# EAGLE design TAH BOARD VER 2.0 (EAGLE 6.4)
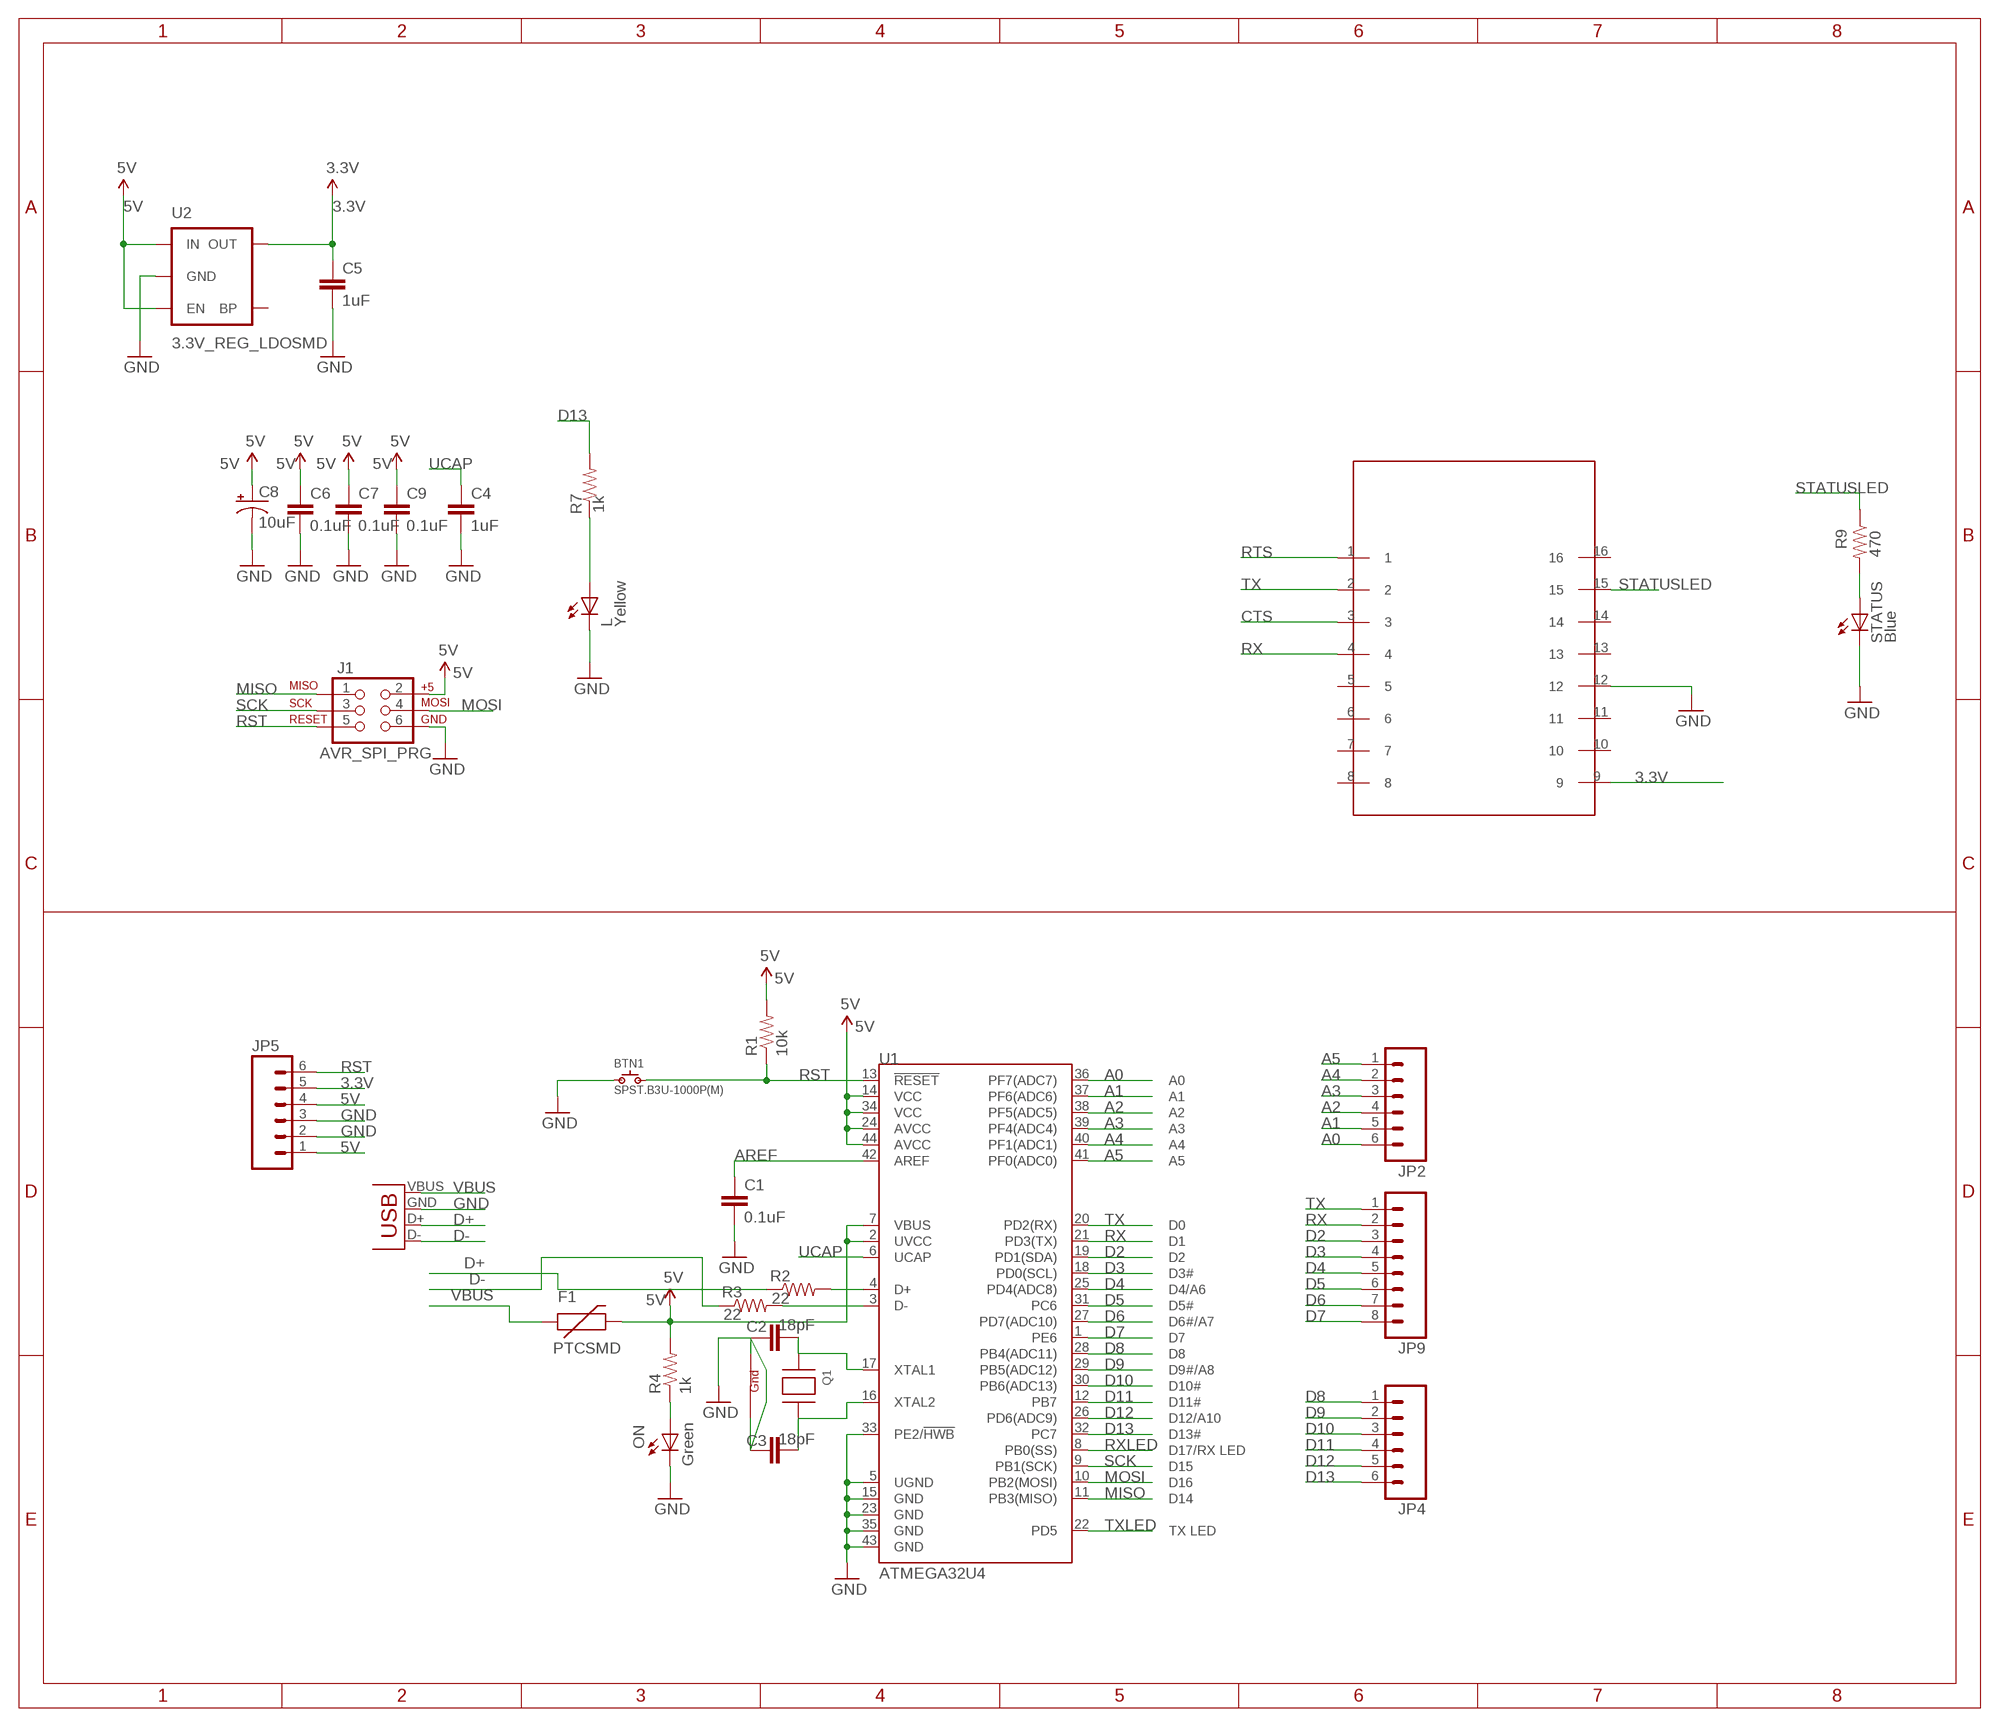
[diagram p0: schematic, sheet 1]

## Parts
BLE  HM-11HM11  [BC05B-SMD]
BTN1  SPST.B3U-1000P(M)  [B3U-1000P(M)]
C1  0.1uF  2.2UF-CERCAP-10009  [1206]
C2  18pF  2.2UF-CERCAP-10009  [1206]
C3  18pF  2.2UF-CERCAP-10009  [1206]
C4  1uF  2.2UF-CERCAP-10009  [1206]
C5  1uF  2.2UF-CERCAP-10009  [1206]
C6  0.1uF  2.2UF-CERCAP-10009  [1206]
C7  0.1uF  2.2UF-CERCAP-10009  [1206]
C8  10uF  CAP_POL1206  [EIA3216]
C9  0.1uF  2.2UF-CERCAP-10009  [1206]
F1  PTCSMD  [PTC-1206]
J1  AVR_SPI_PRG  AVR_SPI_PRG_6PTH  [2X3]
JP2  M06SIP  [1X06]
JP4  M06SIP  [1X06]
JP5  M06SIP  [1X06]
JP7  USB-A-H  [USB-A-H]
JP9  M081X08  [1X08]
L  Yellow  LEDSMT1206  [1206]
ON  Green  LEDSMT1206  [1206]
Q1  XTAL-4-3225  [NX3225]
R1  10k  RESISTOR1206  [1206]
R2  22  RESISTOR1206  [1206]
R3  22  RESISTOR1206  [1206]
R4  1k  RESISTOR1206  [1206]
R7  1k  RESISTOR1206  [1206]
R9  470  RESISTOR1206  [1206]
STATUS  Blue  LEDSMT1206  [1206]
U1  ATMEGA32U4  ATMEGA32U4TQFP  [SPARKFUN-DIGITALIC_TQFP44]
U2  3.3V_REG_LDOSMD  V_REG_LDOSMD  [SOT23-5]

## Nets
3.3V: BLE.9 C5.1 JP5.5 U2.5(OUT)
5V: C6.1 C7.1 C8.A(+) C9.1 F1.2 J1.2 JP5.1 JP5.4 R1.2 R4.2 U1.2(UVCC) U1.7(VBUS) U1.14(VCC) U1.24(AVCC) U1.34(VCC) U1.44(AVCC) U2.1(IN) U2.3(EN)
A0: JP2.6 U1.36(PF7(ADC7))
A1: JP2.5 U1.37(PF6(ADC6))
A2: JP2.4 U1.38(PF5(ADC5))
A3: JP2.3 U1.39(PF4(ADC4))
A4: JP2.2 U1.40(PF1(ADC1))
A5: JP2.1 U1.41(PF0(ADC0))
AREF: C1.1 U1.42(AREF)
CTS: BLE.3
D2: JP9.3 U1.19(PD1(SDA))
D3: JP9.4 U1.18(PD0(SCL))
D4: JP9.5 U1.25(PD4(ADC8))
D5: JP9.6 U1.31(PC6)
D6: JP9.7 U1.27(PD7(ADC10))
D7: JP9.8 U1.1(PE6)
D8: JP4.1 U1.28(PB4(ADC11))
D9: JP4.2 U1.29(PB5(ADC12))
D10: JP4.3 U1.30(PB6(ADC13))
D11: JP4.4 U1.12(PB7)
D12: JP4.5 U1.26(PD6(ADC9))
D13: JP4.6 R7.2 U1.32(PC7)
D+: JP7.D+(D-) R2.1
D-: JP7.D-(D+) R3.1
GND: BLE.12 BTN1.1 C1.2 C2.1 C3.1 C4.2 C5.2 C6.2 C7.2 C8.C(-) C9.2 J1.6 JP5.2 JP5.3 JP7.GND(VBUS) L.C ON.C Q1.2(G2) Q1.4(G1) STATUS.C U1.5(UGND) U1.15(GND) U1.23(GND) U1.33(PE2/!HWB) U1.35(GND) U1.43(GND) U2.2(GND)
MISO: J1.1 U1.11(PB3(MISO))
MOSI: J1.4 U1.10(PB2(MOSI))
N$1: L.A R7.1
N$2: C2.2 Q1.1(X1) U1.17(XTAL1)
N$3: C3.2 Q1.3(X2) U1.16(XTAL2)
N$6: R2.2 U1.4(D+)
N$8: R3.2 U1.3(D-)
N$9: ON.A R4.1
N$11: R9.2 STATUS.A
RST: BTN1.2 J1.5 JP5.6 R1.1 U1.13(!RESET)
RTS: BLE.1
RX: BLE.4 JP9.2 U1.21(PD3(TX))
RXLED: U1.8(PB0(SS))
SCK: J1.3 U1.9(PB1(SCK))
STATUSLED: BLE.15 R9.1
TX: BLE.2 JP9.1 U1.20(PD2(RX))
TXLED: U1.22(PD5)
UCAP: C4.1 U1.6(UCAP)
VBUS: F1.1 JP7.VBUS(GND)
Unconnected: BLE.5 BLE.6 BLE.7 BLE.8 BLE.10 BLE.11 BLE.13 BLE.14 BLE.16 U2.4(BP)

## Library data of the parts
BLE = HM-11:HM-11
BTN1 = omron:SPST
C1-C7 C9 = SparkFun-Capacitors:2.2UF-CER: 2.2uF Ceramic SMT CAP-07888- 10V, 20% (0603) CAP-10009- 50V, 10% (1206); PROD_ID: CAP-10009; VALUE: 2.2uF
C8 = SparkFun:CAP_POL: Capacitor Polarized These are standard SMD and PTH capacitors. Normally 10uF, 47uF, and 100uF in electrolytic and tantalum varieties. Always verify the external diameter of the through hole cap, it varies with capacity, voltage, and manufacturer. The EIA devices should be standard.
F1 = SparkFun:PTC: Resettable Fuse PTC Resettable Fuse. Spark Fun Electronics SKU : COM-08357
J1 = SparkFun:AVR_SPI_PRG_6: AVR ISP 6 Pin This is the reduced ISP connector for AVR programming. Common on Arduino. This footprint will take up less PCB space and can be used with a 10-pin to 6-pin adapter such as SKU: BOB-08508
JP2 JP4 JP5 = SparkFun-Connectors:M06: Header 6 Standard 6-pin 0.1" header. Use with straight break away headers (SKU : PRT-00116), right angle break away headers (PRT-00553), swiss pins (PRT-00743), machine pins (PRT-00117), and female headers (PRT-00115). Molex polarized connector foot print use with SKU : PRT-08094 with associated crimp pins and housings. NOTES ON THE VARIANTS LOCK and LOCK_LONGPADS... This footprint was designed to help hold the alignment of a through-hole component (i.e. 6-pin header) while soldering it into place. You may notice that each hole has been shifted either up or down by 0.005 of an inch from it's more standard position (which is a perfectly straight line). This slight alteration caused the pins (the squares in the middle) to touch the edges of the holes. Because they are alternating, it causes a "brace" to hold the component in place. 0.005 has proven to be the perfect amount of "off-center" position when using our standard breakaway headers. Although looks a little odd when you look at the bare footprint, once you have a header in there, the alteration is very hard to notice. Also, if you push a header all the way into place, it is covered up entirely on the bottom side. This idea of altering the position of holes to aid alignment will be further integrated into the Sparkfun Library for other footprints. It can help hold any component with 3 or more connection pins.
JP7 = SparkFun-Connectors:USB: USB Connectors USB-B-PTH is fully proven SKU : PRT-00139/CONN-08278 USB-miniB is fully proven SKU : PRT-00587 USB-A-PCB is untested. USB-A-H is throughly reviewed, but untested. Spark Fun Electronics SKU : PRT-00437 USB-B-SMT is throughly reviewed, but untested. Needs silkscreen touching up. USB-A-S has not been used/tested USB-MB-H has not been used/tested USB-MICROB has been used. CONN-09505
JP9 = SparkFun-Connectors:M08: Header 8 Standard 8-pin 0.1" header. Use with straight break away headers (SKU : PRT-00116), right angle break away headers (PRT-00553), swiss pins (PRT-00743), machine pins (PRT-00117), and female headers (PRT-00115).
L ON STATUS = 1n4148 diode sot 23:LED: LED OSRAM: - CHIPLED LG R971, LG N971, LY N971, LG Q971, LY Q971, LO R971, LY R971 LH N974, LH R974 LS Q976, LO Q976, LY Q976 LO Q996 - Hyper CHIPLED LW Q18S LB Q993, LB Q99A, LB R99A - SideLED LS A670, LO A670, LY A670, LG A670, LP A670 LB A673, LV A673, LT A673, LW A673 LH A674 LY A675 LS A676, LA A676, LO A676, LY A676, LW A676 LS A679, LY A679, LG A679 - Hyper Micro SIDELED® LS Y876, LA Y876, LO Y876, LY Y876 LT Y87S - SmartLED LW L88C, LW L88S LB L89C, LB L89S, LG L890 LS L89K, LO L89K, LY L89K LS L896, LA L896, LO L896, LY L896 - TOPLED LS T670, LO T670, LY T670, LG T670, LP T670 LSG T670, LSP T670, LSY T670, LOP T670, LYG T670 LG T671, LOG T671, LSG T671 LB T673, LV T673, LT T673, LW T673 LH T674 LS T676, LA T676, LO T676, LY T676, LB T676, LH T676, LSB T676, LW T676 LB T67C, LV T67C, LT T67C, LS T67K, LO T67K, LY T67K, LW E67C LS E67B, LA E67B, LO E67B, LY E67B, LB E67C, LV E67C, LT E67C LW T67C LS T679, LY T679, LG T679 LS T770, LO T770, LY T770, LG T770, LP T770 LB T773, LV T773, LT T773, LW T773 LH T774 LS E675, LA E675, LY E675, LS T675 LS T776, LA T776, LO T776, LY T776, LB T776 LHGB T686 LT T68C, LB T68C - Hyper Mini TOPLED® LB M676 - Mini TOPLED Santana® LG M470 LS M47K, LO M47K, LY M47K Source: http://www.osram.convergy.de/
Q1 = adafruit:XTAL-4: Classic 4-pin 3.2 x 2.5mm crystal
R1-R4 R7 R9 = SparkFun-Resistors:RESISTOR: Resistor Basic schematic elements and footprints for 0603, 1206, and PTH resistors.
U1 = FTDI modifed:ATMEGA32U4: Atmel 44-pin 8-bit Microcontroller with 32KBytes of ISP Flash and USB Controller
U2 = SparkFun:V_REG_LDO: Voltage Regulator LDO Standard 150mA LDO voltage regulator in SOT-23 layout. Micrel part MIC5205. BP (by-pass) pin is used to lower output noise with 470pF cap.

## Net classes
0 default: clearance 0.355 mm

## Board
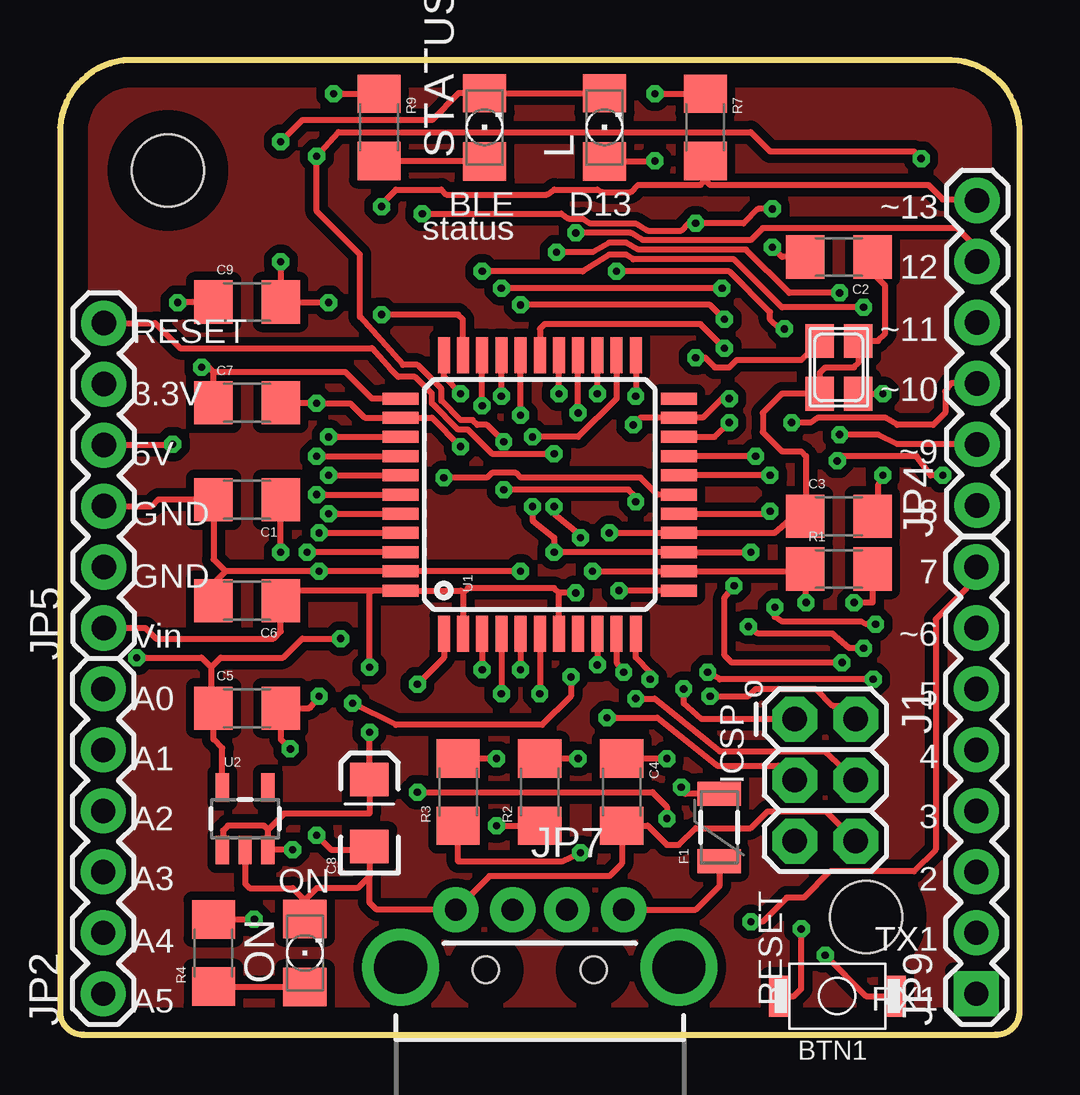
[diagram p1: board, top side]
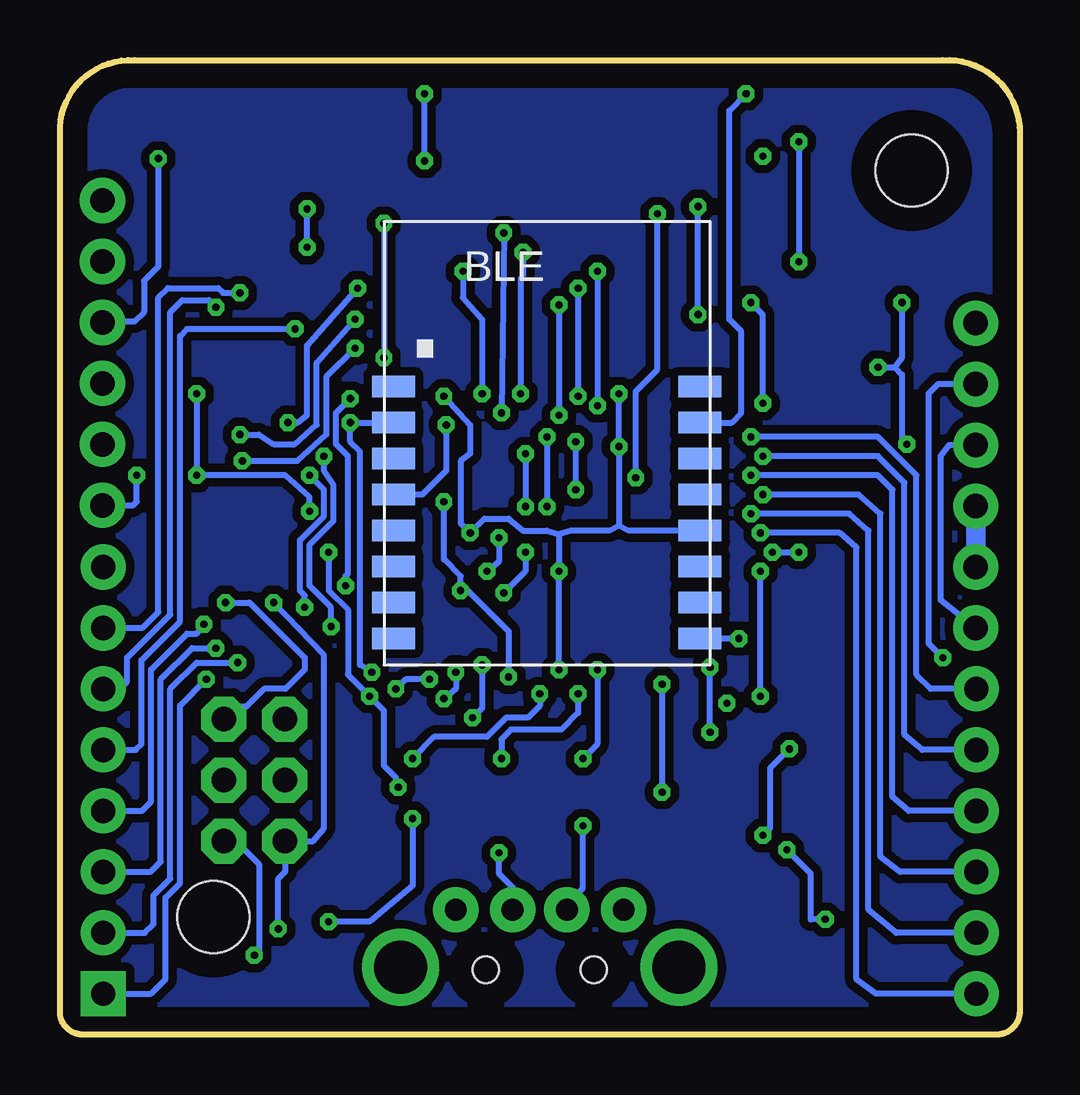
[diagram p2: board, bottom side, seen from below]

Size 40 x 40.61 mm. Coordinates in mm from the lower left corner, seen from the top.
Outline: 3.2,40.6 arc90 0,37.8 0,0.9 arc90 1,0 39,0 arc90 40,0.9 40,37.8 arc90 36.9,40.6 3.2,40.6
Copper layers (1*16): Top 0.035mm / dielectric 1.5mm / Bottom 0.035mm
Design rules "default": minimum track width 10mil, minimum drill 24mil, track to track 8mil, track to pad 8mil, pad to pad 8mil, via to via 8mil, smd to smd 8mil, copper to edge 40mil, drill to drill 8mil, minimum pad ring 10mil, minimum via ring 8mil, stop-mask expansion 4mil, vias tented up to drill 0mil, thermal gap 10mil
Holes 3 mm at 4.5,36 33.6,4.9

### Footprints (pad centres in the part's own frame; a part is rotated, then mirrored left to right if it is on the bottom)
BC05B-SMD = smd 1.8 x 0.9: 1 -6.4,3.4; 2 -6.4,1.9; 3 -6.4,0.4; 4 -6.4,-1.1; 5 -6.4,-2.6; 6 -6.4,-4.1; 7 -6.4,-5.6; 8 -6.4,-7.1; 9 6.38,-7.1; 10 6.38,-5.6; 11 6.38,-4.1; 12 6.38,-2.6; 13 6.38,-1.1; 14 6.38,0.4; 15 6.38,1.9; 16 6.38,3.4
B3U-1000P(M) = smd 0.8 x 1.7: 1 -2.45,0; 2 2.45,0
1206 = smd 1.6 x 1.8: 1 -1.4,0; 2 1.4,0
EIA3216 = smd 1.4 x 1.6: A 1.4,0; C -1.4,0
PTC-1206 = smd 1 x 1.8: 1 -1.4,0; 2 1.4,0
2X3 = drill 1.016 pad 1.88 octagon: 1 0,0; 2 0,2.54; 3 2.54,0; 4 2.54,2.54; 5 5.08,0; 6 5.08,2.54
1X06 = drill 1.016 pad 1.88: 1 0,0; 2 2.54,0; 3 5.08,0; 4 7.62,0; 5 10.16,0; 6 12.7,0
USB-A-H = drill 0.914 pad 1.88: D+ 2.4,1.127; D- 2.4,-1.127; GND 2.4,3.5; VBUS 2.4,-3.5 | drill 2.2: GND2 0,-5.8; GND3 0,5.8 | hole 1.1: -0.1,2.25; -0.1,-2.25
1X08 = drill 1.016 pad 1.88 square: 1 0,0 | drill 1.016 pad 1.88: 2 2.54,0; 3 5.08,0; 4 7.62,0; 5 10.16,0; 6 12.7,0; 7 15.24,0; 8 17.78,0
1206' = smd 1.6 x 1.803: A -1.422,0; C 1.422,0
NX3225 = smd 1.4 x 1.2: 1 -1.1,-0.8; 2 1.1,-0.8; 3 1.1,0.8; 4 -1.1,0.8
SPARKFUN-DIGITALIC_TQFP44 = smd 1.5 x 0.5: 1 -5.8,4; 2 -5.8,3.2; 3 -5.8,2.4; 4 -5.8,1.6; 5 -5.8,0.8; 6 -5.8,0; 7 -5.8,-0.8; 8 -5.8,-1.6; 9 -5.8,-2.4; 10 -5.8,-3.2; 11 -5.8,-4; 23 5.8,-4; 24 5.8,-3.2; 25 5.8,-2.4; 26 5.8,-1.6; 27 5.8,-0.8; 28 5.8,0; 29 5.8,0.8; 30 5.8,1.6; 31 5.8,2.4; 32 5.8,3.2; 33 5.8,4 | smd 0.5 x 1.5: 12 -4,-5.8; 13 -3.2,-5.8; 14 -2.4,-5.8; 15 -1.6,-5.8; 16 -0.8,-5.8; 17 0,-5.8; 18 0.8,-5.8; 19 1.6,-5.8; 20 2.4,-5.8; 21 3.2,-5.8; 22 4,-5.8; 34 4,5.8; 35 3.2,5.8; 36 2.4,5.8; 37 1.6,5.8; 38 0.8,5.8; 39 0,5.8; 40 -0.8,5.8; 41 -1.6,5.8; 42 -2.4,5.8; 43 -3.2,5.8; 44 -4,5.8
SOT23-5 = smd 0.55 x 1.2: 1 -0.95,-1.3; 2 0,-1.3; 3 0.95,-1.3; 4 0.95,1.3; 5 -0.95,1.3

### Placement (x,y rotation side)
BLE  19.7,23.6 0 bottom
BTN1  32.4,1.6 180 top
C1  7.8,22.28 180 top
C2  32.47,32.4 180 top
C3  32.47,21.6 0 top
C4  23.42,10.1 270 top
C5  7.8,13.6 0 top
C6  7.8,18.08 180 top
C7  7.8,26.32 0 top
C8  12.9,9.23 90 top
C9  7.8,30.52 0 top
F1  27.48,8.63 90 top
J1  30.63,13.14 270 top
JP2  1.8,1.7 90 top
JP4  38.23,22.05 90 top
JP5  1.83,16.94 90 top
JP7  20,2.8 90 top
JP9  38.2,1.7 90 top
L  Yellow  [1206']  22.7,37.8 90 top
ON  Green  [1206']  10.21,3.4 90 top
Q1  32.47,27.8 270 top
R1  32.47,19.4 0 top
R2  20,10.1 90 top
R3  16.6,10.1 90 top
R4  6.4,3.4 90 top
R7  26.9,37.8 270 top
R9  13.3,37.8 270 top
STATUS  Blue  [1206']  17.7,37.8 90 top
U1  20,22.5 90 top
U2  7.72,8.99 0 top

### Tracks (layer width: path | path; a pad name or v marks a point on that pad's centre or on a via)
3.3V  (via drill 0.3)
  Top 0.254: U2.5 6.77,11.93 6.4,12.3 C5.1 6.3,13.7 6.3,15.3 | v3.2,15.7 5.9,15.7 6.3,15.3 | 6.3,15.3 6.7,15.7 9.3,15.7 10.1,16.5 v11.7,16.5
  Bottom 0.254: JP5.5 3.4,27.1 3.8,26.7 3.8,16.3 v3.2,15.7 | v11.7,16.5 BLE.9
5V  (via drill 0.3)
  Top 0.254: 8.67,8.53 U2.3 v9.7,7.7 | 8.67,8.53 8.5,8.7 7,8.7 6.8,8.5 6.8,7.72 U2.1 | 8.67,8.53 9.34,9.2 12.9,9.2 C8.A v12.9,12.6 | JP5.1 3.56,16.94 4,16.5 8.9,16.5 9.2,16.8 C6.1 9.62,18.5 13,18.5 | 13,18.5 U1.44 16.7,18.5 16.8,18.4 | U1.34 13,26.5 11.9,27.6 6.4,27.6 | R4.2 v8.1,4.8 | F1.2 26.07,10.03 v25.9,10.3 | v27.1,14.1 28.7,14.1 29,14.4 31.5,14.4 32.2,13.7 32.61,13.7 J1.2 | R1.2 33.87,18 v33.1,18 | v28.8,20.1 U1.14 v20.6,20.1 20.6,20.7 19.7,21.4 v19.7,22 | U1.7 20.8,18.4 | 20.8,18.4 20.6,18.6 17,18.6 16.8,18.4 | 16.8,18.4 U1.2 | v21.5,18.4 20.8,18.4 | U1.24 23.2,26.5 21.6,24.9 v19.7,24.9 | v12.9,15.3 12.9,18.4 13,18.5 | C7.1 6.4,27.6 | 6.4,27.6 6.2,27.8 v5.9,27.8 | v4.7,24.6 4.6,24.56 JP5.4 | C9.1 5.02,30.52 v4.9,30.5
  Bottom 0.254: JP5.4 2.94,24.56 3.3,24.1 3.3,18.11 JP5.1 | v8.1,4.8 8.7,4.8 8.7,6.7 v9.7,7.7 | v25.9,10.3 26,10.7 26.5,11.2 26.5,13.5 v27.1,14.1 28,15 28,17.7 28.8,18.5 v28.8,20.1 | v33.1,18 32.1,18 29.8,15.7 29.8,15.2 30.6,14.4 31.5,14.4 32.25,13.65 32.66,13.65 J1.2 | v20.6,20.1 20.6,19.3 v21.5,18.4 | v19.7,24.9 v19.7,22 | v12.9,12.6 v12.9,15.3 | v5.9,27.8 5.2,27.8 | 5.2,27.8 4.9,27.5 4.9,24.8 v4.7,24.6 | v4.9,30.5 4.9,28.2 5.2,27.8
A0  (via drill 0.3)
  Top 0.254: v11.2,24.9 U1.36
  Bottom 0.254: JP2.6 3.7,14.4 4.3,15 4.3,23.3 5.9,24.9 v11.2,24.9
A1  (via drill 0.3)
  Top 0.254: v10.7,24.1 U1.37
  Bottom 0.254: JP2.5 4.06,11.86 4.8,12.5 4.8,23 5.9,24.1 v10.7,24.1
A2  (via drill 0.3)
  Top 0.254: v11.2,23.3 U1.38
  Bottom 0.254: JP2.4 4.62,9.32 5.3,9.9 5.3,22.7 5.9,23.3 v11.2,23.3
A3  (via drill 0.3)
  Top 0.254: v10.7,22.5 U1.39
  Bottom 0.254: JP2.3 4.98,6.78 5.8,7.4 5.8,21.7 6.7,22.5 v10.7,22.5
A4  (via drill 0.3)
  Top 0.254: v11.2,21.7 U1.40
  Bottom 0.254: JP2.2 5.14,4.24 6.3,5.2 6.3,21 7.1,21.7 v11.2,21.7
A5  (via drill 0.3)
  Top 0.254: v10.8,20.9 U1.41
  Bottom 0.254: JP2.1 6,1.7 6.8,2.3 6.8,20.3 7.5,20.9 v10.8,20.9
AREF  (via drill 0.3)
  Top 0.254: U1.42 v10.3,20.1 | v9.2,20.1 C1.1
  Bottom 0.254: v10.3,20.1 v9.2,20.1
D2  (via drill 0.3)
  Top 0.254: v33.5,16.1 32.9,16.1 32.2,16.7 29.1,16.7 v28.7,17 | v29,24.1 U1.19
  Bottom 0.254: JP9.3 36.22,6.78 35.8,7.2 35.8,14.8 34.5,16.1 v33.5,16.1 | v28.7,17 28.7,17.8 29.6,18.7 29.6,20.4 28.6,21.4 28.6,22.9 29,23.5 v29,24.1
D3  (via drill 0.3)
  Top 0.254: v34,17.1 33.6,17.1 33.4,17.2 30.1,17.2 29.8,17.4 v29.8,17.8 | v29.6,23.3 U1.18
  Bottom 0.254: JP9.4 36.58,9.32 36.2,9.7 36.2,15.2 34.7,16.7 34.3,16.7 v34,17.1 | v29.8,17.8 29.8,18.3 30,18.5 30,20.6 29,21.6 29,22.7 v29.6,23.3
D4  (via drill 0.3)
  Top 0.254: v30.2,29.4 30,29.4 29.6,29.8 29.6,30.1 27.9,31.8 v23.2,31.8 | v22.4,26.7 U1.25
  Bottom 0.254: JP9.5 36.84,11.86 36.6,12.1 36.6,15.6 35,17.2 35,29.1 34.7,29.4 v30.2,29.4 | v23.2,31.8 23.2,30.7 22.4,29.8 v22.4,26.7
D5  (via drill 0.3)
  Top 0.254: v33.5,30.3 30.1,30.3 28.1,32.3 23.9,32.3 23.6,32.5 22.9,32.5 21.8,31.8 v17.6,31.8 | v17.6,26.2 U1.31
  Bottom 0.254: JP9.6 37.5,14.4 37.2,14.7 37.2,15.7 35.4,17.5 35.4,30.1 34.9,30.6 33.8,30.6 v33.5,30.3 | v17.6,31.8 v17.6,26.2
D6  (via drill 0.3)
  Top 0.254: v32.5,30.9 30.4,30.9 28.6,32.7 24.1,32.7 23.6,33 22.9,33 22.2,32.6 v20.7,32.6 | v20.8,26.7 U1.27
  Bottom 0.254: JP9.7 36.56,16.94 35.9,17.6 35.9,30.7 35.5,31.1 33.4,31.1 33.2,30.9 v32.5,30.9 | v20.7,32.6 20.7,31.6 20.8,31.5 v20.8,26.7
D7  (via drill 0.3)
  Top 0.254: v28.8,4.7 29.3,4.7 30.3,5.7 31,5.7 32.1,6.8 35.6,6.8 36.5,7.7 36.5,17.3 37.8,18.6 37.8,19.2 JP9.8 | v14.9,10.1 24.7,10.1 25.3,9.5 v25.3,9 | v14.9,14.6 16,15.7 U1.1
  Bottom 0.254: v28.8,4.7 27.1,4.7 25.3,6.2 v25.3,9 | v14.9,14.6 v14.9,10.1
D8  (via drill 0.3)
  Top 0.254: v36.8,23.3 36.3,23.3 35.7,24.1 32.5,24.1 32.4,24 v32.4,23.9 | v27.7,28.6 26.7,29.6 20.2,29.6 20,29.4 U1.28
  Bottom 0.254: JP4.1 36.95,22.05 36.8,22.2 v36.8,23.3 | v32.4,23.9 30.1,23.9 28.9,25 28.9,27.4 v27.7,28.6
D9  (via drill 0.3)
  Top 0.254: JP4.2 37.91,24.59 37.6,24.6 34.9,24.6 34.1,25 v32.5,25 | v27.7,29.8 27.1,30.4 v19.2,30.4 | v19.2,25.8 U1.29
  Bottom 0.254: v32.5,25 31.7,25 31.1,24.6 30.2,24.6 29.3,25.4 29.3,28 v27.7,29.8 | v19.2,30.4 v19.2,25.8
D10  (via drill 0.3)
  Top 0.254: JP4.3 37.13,27.13 36.9,26.8 36.9,25.9 36.4,25.4 34.9,25.4 34.4,25.7 31.6,25.7 31.3,25.5 v30.5,25.5 | v27.6,31.1 v18.4,31.1 | v18.4,26.6 U1.30
  Bottom 0.254: v30.5,25.5 30.1,25.5 29.7,25.8 29.7,28.7 v27.6,31.1 | v18.4,31.1 v18.4,26.6
D11  (via drill 0.3)
  Top 0.254: v21.3,14.9 21.3,14.1 20.1,12.9 14,12.9 v12.2,13.8 | v35.9,36.5 35.6,36.8 29.6,36.8 28.8,37.6 11.6,37.6 v10.7,36.6 10.7,34.3 12.5,32.5 12.5,29.9 14.3,27.9 14.9,27.9 15.9,26.9 15.9,26.4 16.7,25.6 17.2,25.6 17.4,25.4 17.8,25.4 v18.5,24.7 | U1.12 v23.3,18.5 | v24,22.2 24,22.4 23.7,22.7 v18.5,22.7
  Bottom 0.254: v21.3,14.9 21.3,16.8 23,18.5 v23.3,18.5 23.3,19.1 24,19.8 v24,22.2 | v35.9,36.5 35.9,32 36.5,31.4 36.5,30.1 36.9,29.7 38.2,29.7 JP4.4 | v18.5,22.7 v18.5,24.7
D12  (via drill 0.3)
  Top 0.254: JP4.5 38.23,32.77 37.4,33.6 29.3,33.6 28.8,33.1 24.3,33.1 23.8,33.4 v21.5,33.4 | v21.6,25.9 U1.26
  Bottom 0.254: v21.5,33.4 v21.6,25.9
D13  (via drill 0.3)
  Top 0.254: U1.32 16.8,29.8 16.6,30 v13.4,30 | v13.4,34.5 13.4,34.6 14,35.2 15.9,35.2 16.1,35 20.3,35 20.6,35.2 22.4,35.2 22.6,35.1 23.8,35.1 24.1,35.4 26.7,35.4 26.9,35.6 | 26.9,35.6 R7.2 | 26.9,35.6 27.1,35.4 36.2,35.4 36.8,34.8 38.18,34.8 JP4.6
  Bottom 0.254: v13.4,30 v13.4,34.5
D+  (via drill 0.3)
  Top 0.254: v18.2,8.7 R2.1
  Bottom 0.254: JP7.D+ 18.87,5.43 18.2,6.1 v18.2,8.7
D-  (via drill 0.3)
  Top 0.254: v21.7,7.57 20.9,7.2 16.6,7.2 R3.1
  Bottom 0.254: JP7.D- 21.13,6.13 21.7,6.7 v21.7,7.57
GND  (via drill 0.3)
  Top 0.254: U1.5 v19.2,15.2 | v19.2,19.3 U1.43 v10.8,19.3 6.9,19.3 | U1.23 v24,26.6 | v22.9,20.9 U1.15 29.8,20.9 30.6,21.6 C3.1 31.1,21.63 31.1,24.1 30.9,24.3 30.1,24.3 29.3,25.1 29.3,25.9 30.1,26.7 Q1.2 31.67,27.57 31.9,27.8 33.1,27.8 33.3,28 33.3,28.87 Q1.4 34.1,28.9 34.4,29.2 34.4,31.2 33.9,31.7 33.9,32.37 C2.1 | C7.2 10.68,26.32 v10.7,26.3 12.1,26.3 12.7,25.7 U1.35 15.5,25.7 v16.7,24.5 | v11.2,30.5 9.22,30.5 C9.2 v9.2,32.2 | v16.7,26.7 16,27.4 U1.33 | v10.8,14.1 10.4,13.6 C5.2 9.2,12.3 v9.6,11.9 | 6.9,19.3 6.4,18.8 C6.2 | U2.2 7.72,6.28 7.9,6.1 9.7,6.1 10.2,5.6 | 10.2,5.6 10.2,4.83 ON.C | 12.9,6.6 C8.C 12.77,7.7 11.3,7.7 v10.7,8.3 | 12.9,6.6 12.4,6.1 10.7,6.1 10.2,5.6 | 12.9,6.6 12.9,5.5 13.2,5.2 JP7.GND 17.9,6.6 22.9,6.6 23.42,7.12 C4.2 24.5,8.7 25.3,7.9 25.8,7.9 26.5,8.6 28.8,8.6 29.5,9.3 31.93,9.3 J1.6 | L.C STATUS.C 16.62,39.22 15.5,38.1 10.1,38.1 v9.2,37.2 | JP5.3 3.82,22.02 4.1,22.3 6.38,22.3 C1.2 6.4,19.8 6.9,19.3 | v31.9,3.3 33.6,1.6 BTN1.1
  Bottom 0.254: v19.2,15.2 v19.2,19.3 19.2,20.85 | v24,26.6 22.9,25.4 22.9,24.2 23.3,23.9 23.3,21.3 v22.9,20.9 22.3,21.5 21.3,21.5 20.7,21 19.7,21 19.2,20.85 | v10.7,26.3 10.7,30 v11.2,30.5 | v16.7,26.7 v16.7,24.5 16.7,21.2 | v10.8,14.1 v10.8,19.3 | v9.6,11.9 10.4,11.1 10.4,8.6 v10.7,8.3 | v9.2,37.2 v9.2,32.2 | 16.7,21.2 17.1,21 18.7,21 19.2,20.85 | BLE.12 16.3,21 16.7,21.2 | J1.6 32.66,8.06 31.7,7.1 31.7,3.5 v31.9,3.3
  Bottom 0.813: JP5.2 JP5.3
MISO  (via drill 0.3)
  Top 0.254: J1.1 26.76,13.14 26,13.8 v26,14.4 | v24.6,14.8 24.6,15.1 24,15.7 U1.11
  Bottom 0.254: v24.6,14.8 25.6,14.8 v26,14.4
MOSI  (via drill 0.3)
  Top 0.254: U1.10 23.2,15.5 v23.5,15.1 | v24,14 24.8,14 27.5,11.8 31.87,11.8 J1.4
  Bottom 0.254: v23.5,15.1 23.5,14.4 v24,14
N$1  (via drill 0.3)
  Top 0.254: L.A 24.78,36.38 v24.8,36.4 | v24.8,39.2 R7.1
  Bottom 0.254: v24.8,36.4 v24.8,39.2
N$2  (via drill 0.3)
  Top 0.254: v26.5,28.2 26.9,28.2 27.3,27.8 27.9,27.8 28.2,28.1 30.9,28.1 31.7,28.9 Q1.1 | v15.1,34.2 20.9,34.2 21.2,34 21.8,34 22.1,33.8 24,33.8 24.5,33.5 25.9,33.5 26.2,33.8 v26.5,33.8 28.5,33.8 29.1,34.4 v29.7,34.4 | v16,23.2 17.8,23.2 18,23.4 19,23.4 19.2,23.2 24.2,23.2 24.9,22.5 U1.17 | C2.2 30.1,32.4 v29.7,32.8
  Bottom 0.254: v26.5,33.8 v26.5,28.2 | v15.1,34.2 15.1,27.7 16,26.8 v16,23.2 | v29.7,32.8 v29.7,34.4
N$3  (via drill 0.3)
  Top 0.254: Q1.3 v34.3,26.7 | v34.3,23.3 34.1,22.9 34.1,22.03 C3.2 | U1.16 29.5,21.7 v29.6,21.8
  Bottom 0.254: v34.3,26.7 v34.3,23.3 30.6,23.3 29.6,22.4 v29.6,21.8
N$4
  pour Top: 0.9,0 39,0 arc90 40,1 40,37.7 arc90 37.1,40.6 2.9,40.6 arc90 0,37.7 0,0.9 arc90
  pour Bottom: 0.9,0 39,0 arc90 40,1 40,37.7 arc90 37.1,40.6 2.9,40.6 arc90 0,37.7 0,0.9 arc90
N$6  (via drill 0.3)
  Top 0.254: U1.4 v18.4,14.2 | v21.6,11.5 R2.2
  Bottom 0.254: v18.4,14.2 18.4,13.4 19.1,12.7 21.2,12.7 21.6,12.3 v21.6,11.5
N$8  (via drill 0.3)
  Top 0.254: U1.3 v17.6,15.2 | v18.2,11.5 R3.2
  Bottom 0.254: v17.6,15.2 17.6,12.1 v18.2,11.5
N$9
  Top 0.254: R4.1 10.19,2 ON.A
N$11
  Top 0.254: STATUS.A 13.32,36.38 R9.2
RST  (via drill 0.3)
  Top 0.254: v31.1,18 31.1,19.37 R1.1 30.67,19.3 U1.13 v22.2,19.3 | JP5.6 3.96,29.64 5,28.6 13,28.6 13.8,27.7 14.1,27.4 14.8,27.4 15.5,26.7 15.5,26.3 16.6,25.2 17,25.2 18,24.2 v20.6,24.2 | BTN1.2 30.6,1.6 30.9,1.9 v30.9,4.4 | v20.6,22 20.6,21.7 21.7,20.8 v21.7,20.7
  Bottom 0.254: v31.1,18 29,15.8 29,8.6 29.44,8.06 J1.5 30.6,8.03 30.6,6.8 30.9,6.5 v30.9,4.4 | v20.6,24.2 v20.6,22 | v21.7,20.7 21.7,19.7 v22.2,19.3
RX  (via drill 0.3)
  Top 0.254: v32.6,15.5 28,15.5 27.7,15.8 27.7,18.2 v28.1,18.7 | v23.9,25.4 24.2,25.7 U1.21 26.8,25.7 27.6,26.5 v27.9,26.5
  Bottom 0.254: JP9.2 36.46,4.24 36.1,4.6 36.1,5.8 35.4,6.5 35.4,14.4 34.3,15.5 v32.6,15.5 | v23.9,25.4 23.9,23.5 24.9,22.5 BLE.4 | v28.1,18.7 28.1,19.1 28,19.2 28,24.1 28.5,24.6 28.5,25.9 v27.9,26.5
SCK  (via drill 0.3)
  Top 0.254: U1.9 v22.4,15.4 | v22.8,13.2 24.9,13.2 27.4,11.2 29.93,11.2 J1.3
  Bottom 0.254: v22.4,15.4 22.4,13.6 v22.8,13.2
STATUSLED  (via drill 0.3)
  Top 0.254: v11.4,39.2 R9.1
  Bottom 0.254: BLE.15 12,25.5 11.6,25.9 11.6,29.3 12.1,29.8 12.1,38.5 v11.4,39.2
TX  (via drill 0.3)
  Top 0.254: v33.9,14.8 27.5,14.8 v27,15.1 | U1.20 27.3,24.9 v27.9,25.5
  Bottom 0.254: JP9.1 36.2,1.7 35.6,2.3 35.6,5.7 35,6.3 35,13.7 v33.9,14.8 | BLE.2 v27.9,25.5 27.9,24.7 27.5,24.3 27.5,15.4 v27,15.1
UCAP  (via drill 0.3)
  Top 0.254: U1.6 v20,14.2 | v25.3,11.5 C4.1
  Bottom 0.254: v20,14.2 20,13.7 20.5,13.2 21.4,13.2 22.2,12.4 24.4,12.4 v25.3,11.5
VBUS
  Top 0.254: JP7.VBUS 26.5,5.2 27.5,6.2 27.5,7.21 F1.1

### Text on the board
_tNames: ~13 | BLE | D13 | status | 12 | ~11 | RESET | ~10 | 3.3V | ~9 | 5V | 8 | GND | 7 | GND | ~6 | Vin | o | 5 | A0 | ICSP | 4 | A1 | 3 | A2 | 2 | A3 | ON | RESET | TX1 | A4 | RX1 | A5